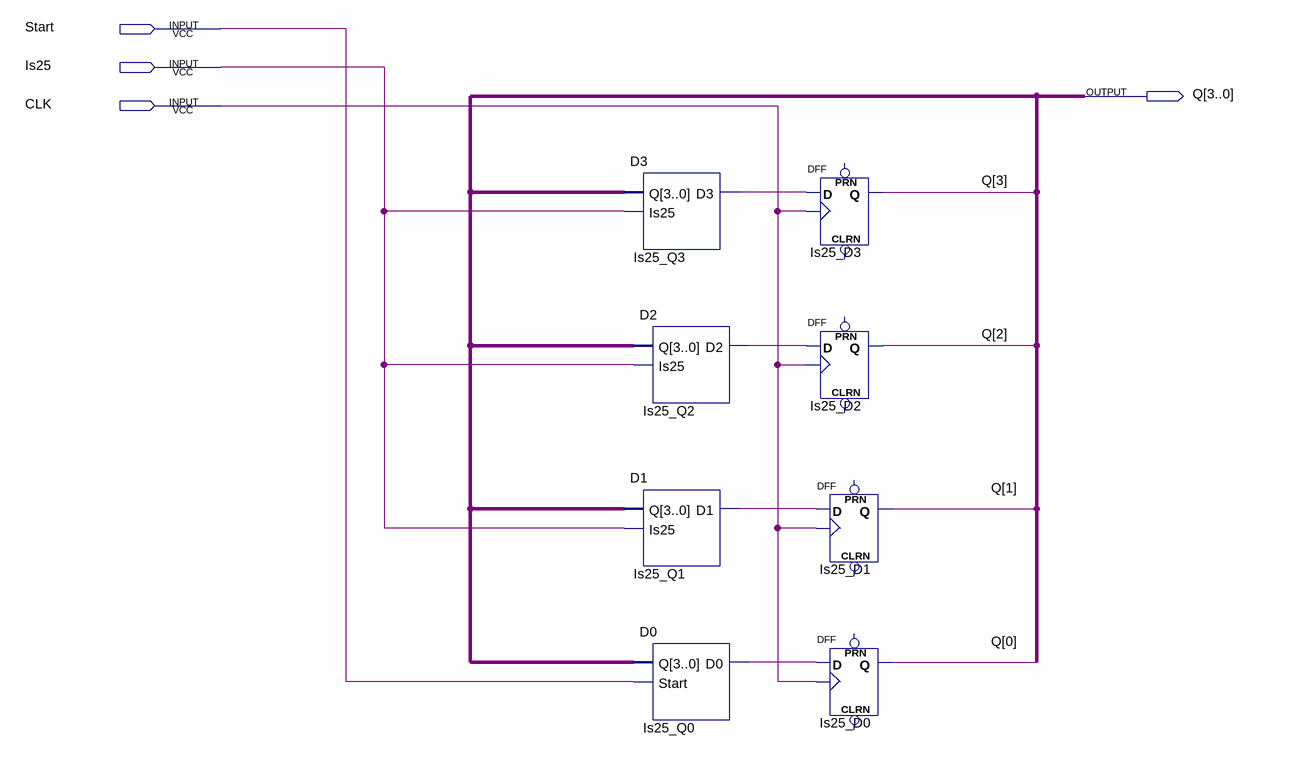
[diagram p0: schematic sheet]
// Quartus schematic Start_Is25.bdf as structural Verilog: 8 symbols, 4 pins
module Start_Is25 (
  input  Start,
  input  Is25,
  input  CLK,
  output [3:0] Q
);

  wire Is25_Q0_d0, Is25_Q1_d1, Is25_Q2_d2, Is25_Q3_d3;

  D3 Is25_Q3 (.Q(Q), .Is25(Is25), .D3(Is25_Q3_d3));
  D1 Is25_Q1 (.Q(Q), .Is25(Is25), .D1(Is25_Q1_d1));
  D2 Is25_Q2 (.Q(Q), .Is25(Is25), .D2(Is25_Q2_d2));
  D0 Is25_Q0 (.Q(Q), .Start(Start), .D0(Is25_Q0_d0));
  DFF Is25_D3 (.CLK(CLK), .D(Is25_Q3_d3), .Q(Q[3]));  // open: CLRN, PRN
  DFF Is25_D2 (.CLK(CLK), .D(Is25_Q2_d2), .Q(Q[2]));  // open: CLRN, PRN
  DFF Is25_D1 (.CLK(CLK), .D(Is25_Q1_d1), .Q(Q[1]));  // open: CLRN, PRN
  DFF Is25_D0 (.CLK(CLK), .D(Is25_Q0_d0), .Q(Q[0]));  // open: CLRN, PRN
endmodule
